# EasyEDA Pro project ProProject_赤兔主板（夜燕flex）111_2024-08-22.epro, board PCB_夜燕Flex
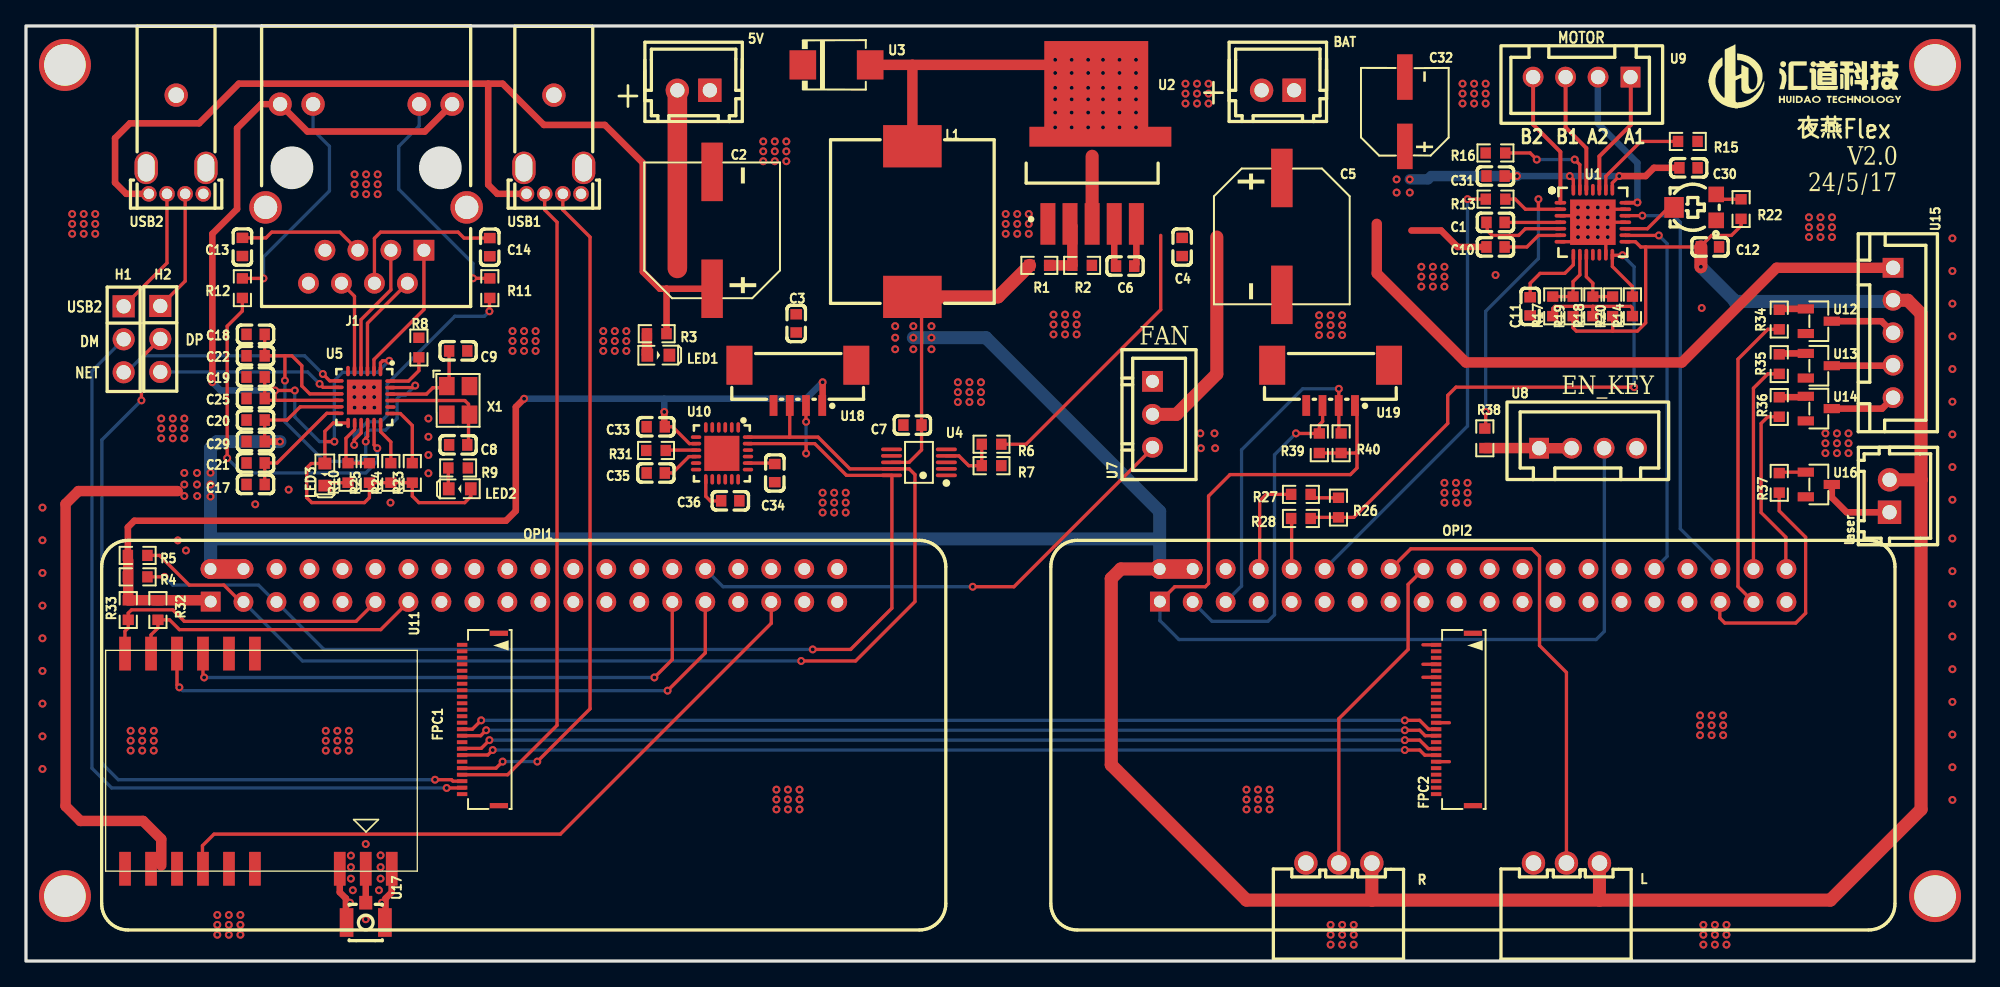
[diagram p2: board, top side]
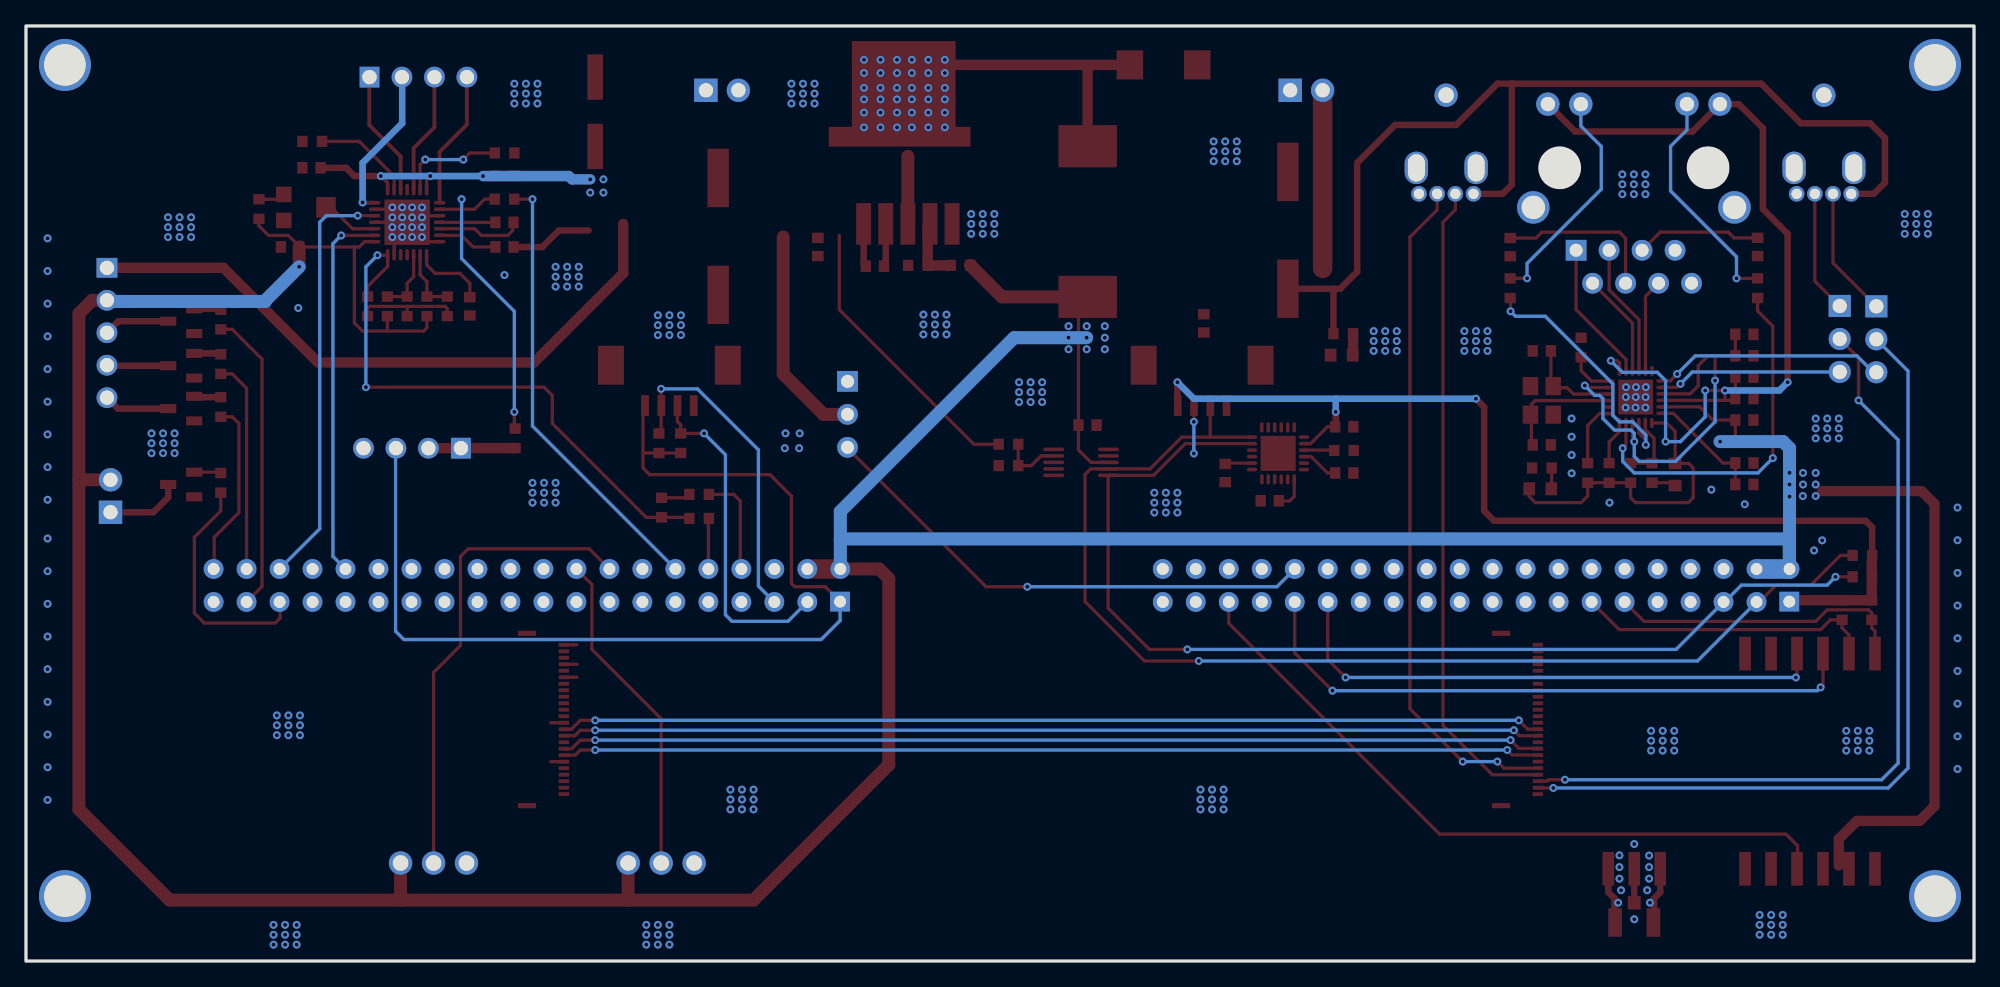
[diagram p3: board, bottom side, seen from below]

Outline 150 x 72 mm; copper layers: Top Layer, Bottom Layer. Coordinates in mm from the lower left corner of the outline.
Outline path: rectangle 0,72 150,0
Stack: Top Layer 0.035mm / Dielectric1 1.51mm FR4 er 4.5 / Bottom Layer 0.035mm

## Design rules (mm)
template: 用户自定义配置
spacing Default (default): track to track 0.152, other pairs 0 to 0.152
track width Default (default): min 0.254, default 0.254, max 25.4
differential pair differentialPair (default): width min 0.127, default 0.254, max 2.54; gap min 0.152, default 0.152
via Default (default): diameter min 0.61, default 0.61, max 100.025; hole min 0.305, default 0.305, max 59.995
net +5V uses power
net 24V uses power

## Placement (name value [footprint] x y rotation side)
5V  ZX-XH2.54-2PZZ  [CONN-TH_2P-P2.50_HX25003-2A]  51.41 67.05 180 top
BAT  ZX-XH2.54-2PZZ  [conn-th_2p-p2.50_hx25003-2a]  96.39 67.05 180 top
C1  22nF  [C0603]  113.16 56.87 0 top
C2  220uF  [CAP-SMD_BD10.0-L10.3-W10.3-LS11.0-FD]  52.83 56.27 90 top
C3  100nF  [C0603]  59.31 49.1 90 top
C4  100nF  [C0603]  89.03 54.98 90 top
C5  220uF  [CAP-SMD_BD10.0-L10.3-W10.3-LS11.0-FD]  96.7 55.8 270 top
C6  1uF  [C0603]  84.63 53.51 0 top
C7  100nF  [C0603]  68.26 41.27 0 top
C8  22pF  [footprint_d276]  33.28 39.74 0 top
C9  22pF  [footprint_d276]  33.28 46.98 0 top
C10  100nF  [C0603]  113.16 54.98 0 top
C11  2.2u  [footprint_d276]  115.82 50.41 90 top
C12  100nF  [C0603]  129.67 54.99 180 top
C13  100nF  [C0603]  16.67 54.98 90 top
C14  100nF  [C0603]  35.71 54.97 90 top
C17  1uF  [C0603]  17.68 36.7 0 top
C18  1uF  [C0603]  17.68 48.25 0 top
C19  4.7uF  [C0603]  17.68 44.97 0 top
C20  4.7uF  [C0603]  17.68 41.66 0 top
C21  100nF  [C0603]  17.68 38.35 0 top
C22  100nF  [C0603]  17.68 46.6 0 top
C25  100nF  [C0603]  17.68 43.31 0 top
C29  100nF  [C0603]  17.68 40 0 top
C30  100nF  [C0603]  128.02 61.08 180 top
C31  100nF  [C0603]  113.16 60.44 0 top
C32  100uF  [CAP-SMD_BD6.3-L6.6-W6.6-LS7.4-FD]  106.17 65.4 90 top
C33  10nF  [C0603]  48.49 41.14 180 top
C34  2.2nF  [C0603]  57.66 37.57 270 top
C35  100nF  [C0603]  48.49 37.58 180 top
C36  100nF  [C0603]  54.23 35.44 180 top
FPC1  F0502-B-24-10G-R  [FPC-SMD_F0502-B-24-10G-R]  35 18.6 90 top
FPC2  F0502-B-24-10G-R  [FPC-SMD_F0502-B-24-10G-R]  110 18.6 90 top
H1  PZ254V-11-03P  [HDR-TH_3P-P2.54-V-M]  7.52 47.87 270 top
H2  PZ254V-11-03P  [HDR-TH_3P-P2.54-V-M]  10.34 47.9 270 top
J1  HR911105A  [RJ45-TH_HR911105A]  26.19 59.08 180 top
L  XH-3AW  [CONN-TH_3P-P2.54_HCTL_XH-3AW]  118.62 7.55 180 top
L1  47uH  [IND-SMD_L13.8-W12.6_YSPI13XX]  68.25 56.94 90 top
laser  ZX-XH2.54-2PZZ  [CONN-TH_2P-P2.50_HX25003-2A]  143.49 35.81 90 top
LED1  LED-0603_R  [footprint_3abe]  48.69 46.65 0 top
LED2  LED-0603_R  [footprint_3abe]  33.4 36.36 180 top
LED3  LED-0603_R  [footprint_3abe]  23.02 37.46 270 top
NOREF  -  [Pad_e399]  147 5 0 top
NOREF#2  -  [Pad_e392]  3 69 0 top
NOREF#3  -  [Pad_e400]  147 69 0 top
NOREF#4  -  [Pad_e398]  3 5 0 top
OPI1  香橙派ZERO2W_正扣  [footprint_d6d0]  37.85 16.5 0 top
OPI2  香橙派ZERO2W_正扣  [footprint_d6d0]  110.93 16.5 0 top
R  XH-3AW  [CONN-TH_3P-P2.54_HCTL_XH-3AW]  101.09 7.55 180 top
R1  15k  [footprint_b147]  78.03 53.57 180 top
R2  4.7k  [footprint_b147]  81.32 53.57 180 top
R3  1k  [footprint_b147]  48.57 48.3 0 top
R4  10kΩ  [R0603]  8.6 29.58 180 top
R5  10kΩ  [R0603]  8.6 31.23 180 top
R6  100k  [footprint_b147]  74.35 39.79 0 top
R7  20k  [footprint_b147]  74.35 38.14 180 top
R8  2.49k  [footprint_b147]  30.25 47.24 90 top
R9  510R  [footprint_b147]  33.27 37.97 0 top
R10  510R  [footprint_b147]  24.79 37.59 90 top
R11  510R  [footprint_b147]  35.72 51.81 90 top
R12  510R  [footprint_b147]  16.66 51.81 90 top
R13  2k  [footprint_b147]  113.16 58.67 0 top
R14  20k  [footprint_b147]  123.7 50.41 90 top
R15  120mR  [footprint_b147]  127.96 63.11 0 top
R16  120mR  [footprint_b147]  113.15 62.22 180 top
R17  0  [footprint_b147]  117.56 50.41 90 top
R18  0  [footprint_b147]  120.65 50.41 90 top
R19  10kΩ  [R0603]  119.13 50.41 90 top
R20  10kΩ  [R0603]  122.17 50.41 90 top
R21  20kΩ  [footprint_3e76]  128.52 58.03 90 top
R22  20k  [footprint_b147]  132.06 57.9 270 top
R23  10kΩ  [R0603]  29.75 37.59 270 top
R24  10kΩ  [R0603]  28.1 37.59 270 top
R25  10kΩ  [R0603]  26.44 37.59 270 top
R26  1k  [footprint_b147]  101.06 34.92 270 top
R27  0  [footprint_b147]  98.17 35.93 0 top
R28  0  [footprint_b147]  98.17 34.08 0 top
R31  4.7K  [R0603]  48.51 39.31 0 top
R32  1k  [R0603]  10.16 27.03 270 top
R33  1k  [R0603]  7.87 27.03 270 top
R34  10  [R0603]  135 49.39 90 top
R35  10  [R0603]  135 45.97 90 top
R36  10  [R0603]  135 42.66 90 top
R37  10  [R0603]  135 36.82 90 top
R38  2K  [R0603]  112.33 40.25 270 top
R39  10kΩ  [R0603]  99.59 39.87 270 top
R40  10kΩ  [R0603]  101.27 39.87 270 top
U1  TMC2209-LA  [footprint_e6f4]  120.65 56.89 270 top
U2  XL4015E1  [footprint_c660]  82.09 61.77 90 top
U3  SS54_C5200096  [footprint_a0e0]  62.41 69 0 top
U4  ADS1115IDGSR  [footprint_abbe]  68.76 38.4 90 top
U5  RTL8152B-VB-CG  [footprint_86b9]  26.06 43.43 270 top
U7  ZX-XH2.54-3PZZ  [CONN-TH_3P-P2.54_2501S-3P]  86.74 42.09 270 top
U8  ZX-XH2.54-4PZZ  [CONN-TH_4P-P2.50_4PIN]  120.26 39.49 0 top
U9  ZX-XH2.54-4PZZ  [CONN-TH_4P-P2.50_4PIN]  119.8 68.06 180 top
U10  MPU-6050_C24112  [QFN-24_L4.0-W4.0-P0.50-BL-EP2.7]  53.6 39.09 180 top
U11  -  [MW1268S]  18.16 15.48 270 top
U12  2N7002K_C3008053  [SOT-23-3_L2.9-W1.3-P1.90-LS2.4-BL-1]  138.05 49.27 270 top
U13  2N7002K_C3008053  [SOT-23-3_L2.9-W1.3-P1.90-LS2.4-BL-1]  138.05 45.84 270 top
U14  2N7002K_C3008053  [SOT-23-3_L2.9-W1.3-P1.90-LS2.4-BL-1]  138.05 42.54 270 top
U15  ZX-XH2.54-5PZZ  [CONN-TH_5P-P2.50_ZX-XH2.54-5PZZ]  143.76 48.38 270 top
U16  2N7002K_C3008053  [SOT-23-3_L2.9-W1.3-P1.90-LS2.4-BL-1]  138.05 36.69 270 top
U17  BWU.FL-IPEX1  [IPEX-SMD_BWIPX-1-001E]  26.16 3.73 270 top
U18  HCZZ0015-4  [CONN-SMD_4P-P1.25_HCZZ0015-4]  59.44 44.33 180 top
U19  HCZZ0015-4  [CONN-SMD_4P-P1.25_HCZZ0015-4]  100.46 44.33 180 top
USB1  AF 14.0 CC-T  [USB-A-TH_AF14.0CC-T]  40.64 62.87 180 top
USB2  AF 14.0 CC-T  [USB-A-TH_AF14.0CC-T]  11.56 62.87 180 top
X1  25MHz  [OSC-SMD_4P-L3.2-W2.5-BL]  33.28 43.17 270 top

## Footprints (pads in the part's own frame, mm; a bottom-side part is the same pattern mirrored in y, then rotated)
C0603
  rect 0.8x0.9 smd: 1(-0.7,0) 2(0.7,0)
CAP-SMD_BD6.3-L6.6-W6.6-LS7.4-FD
  rect 3.5x1.2 smd: 1(-2.67,0) 2(2.67,0)
CAP-SMD_BD10.0-L10.3-W10.3-LS11.0-FD
  rect 4.5x1.65 smd: 1(-4.5,0) 2(4.5,0)
CONN-SMD_4P-P1.25_HCZZ0015-4
  rect 0.6x1.6 smd: 1(-1.875,1.55) 2(-0.625,1.55) 3(0.625,1.55) 4(1.875,1.55)
  rect 2x3 smd: 5(-4.5,-1.55) 6(4.5,-1.55)
CONN-TH_2P-P2.50_HX25003-2A
  rect 1.8x1.8 hole 1.1: 1(-1.25,0)
  round 1.8 hole 1.1: 2(1.25,0)
conn-th_2p-p2.50_hx25003-2a
  rect 1.8x1.8 hole 1.1: 1(-1.25,0)
  round 1.8 hole 1.1: 2(1.25,0)
CONN-TH_3P-P2.54_2501S-3P
  rect 1.6x1.6 hole 1: 1(-2.54,0)
  round 1.6 hole 1: 2(0,0) 3(2.54,0)
CONN-TH_3P-P2.54_HCTL_XH-3AW
  round 1.8 hole 1.199: 1(-2.54,0) 2(0.002,0) 3(2.54,0)
CONN-TH_4P-P2.50_4PIN
  rect 1.524x1.6 hole 1.1: 1(-3.75,0)
  round 1.6 hole 1.1: 2(-1.25,0) 3(1.25,0) 4(3.75,0)
CONN-TH_5P-P2.50_ZX-XH2.54-5PZZ
  rect 1.524x1.6 hole 1.1: 1(-5,0)
  round 1.6 hole 1.1: 2(-2.5,0) 3(0,0) 4(2.5,0) 5(5,0)
footprint_3abe
  rect 0.9x1 smd: 1(-0.85,0) 2(0.85,0)
footprint_3e76
  rect 1.2x1.2 smd: 1(-1,-1.625) 3(1,-1.625)
  rect 1.6x1.5 smd: 2(0,1.625)
footprint_86b9
  oval 0.8x0.28 smd: 1(-2,1.232) 2(-2,0.732) 3(-2,0.231) 4(-2,-0.267) 5(-2,-0.767) 6(-2,-1.268) 13(2,-1.258) 14(2,-0.757) 15(2,-0.257) 16(2,0.241) 17(2,0.742) 18(2,1.242)
  oval 0.28x0.8 smd: 7(-1.244,-2) 8(-0.744,-2) 9(-0.244,-2) 10(0.254,-2) 11(0.754,-2) 12(1.255,-2) 19(1.27,2) 20(0.769,2) 21(0.269,2) 22(-0.229,2) 23(-0.729,2) 24(-1.23,2)
  rect 2.68x2.68 smd: 25(0,-0.013)
footprint_a0e0
  rect 2.047x2.241 smd: 1(-2.591,0) 2(2.591,0)
footprint_abbe
  oval 0.28x1.62 smd: 1(-1,-2.11) 2(-0.5,-2.11) 3(0,-2.11) 4(0.5,-2.11) 5(1,-2.11) 6(1,2.11) 7(0.5,2.11) 8(0,2.11) 9(-0.5,2.11) 10(-1,2.11)
footprint_b147
  rect 0.806x0.864 smd: 1(-0.753,0) 2(0.753,0)
footprint_c660
  rect 3.2x1.15 smd: 1(-5.008,3.404) 2(-5.008,1.702) 3(-5.008,0) 4(-5.008,-1.702) 5(-5.008,-3.404)
  custom 8.128x10.922 smd: 6(5.008,-0.318)
footprint_d6d0
  rect 1.524x1.524 hole 0.914: 1(-23.622,11.176)
  round 1.524 hole 0.914: 2(-21.098,11.148) 3(-18.558,11.148) 4(-16.018,11.148) 5(-13.478,11.148) 6(-10.938,11.148) 7(-8.398,11.148) 8(-5.858,11.148) 9(-3.318,11.148) 10(-0.778,11.148) 11(1.762,11.148) 12(4.302,11.148) 13(6.841,11.148) 14(9.382,11.148) 15(11.921,11.148) 16(14.461,11.148) 17(17.002,11.148) 18(19.541,11.148) 19(22.081,11.148) 20(24.622,11.148) 21(24.622,13.688) 22(22.081,13.688) 23(19.541,13.688) 24(17.002,13.688) 25(14.461,13.688) 26(11.921,13.688) 27(9.382,13.688) 28(6.841,13.688) 29(4.302,13.688) 30(1.762,13.688) 31(-0.778,13.688) 32(-3.318,13.688) 33(-5.858,13.688) 34(-8.398,13.688) 35(-10.938,13.688) 36(-13.478,13.688) 37(-16.018,13.688) 38(-18.558,13.688) 39(-21.098,13.688) 40(-23.638,13.688)
footprint_d276
  rect 0.8x0.9 smd: 1(-0.7,0) 2(0.7,0)
footprint_e6f4
  oval 0.28x0.9 smd: 1(-1.501,-2.5) 2(-1.001,-2.5) 3(-0.5,-2.5) 4(0,-2.5) 5(0.5,-2.5) 6(1.001,-2.5) 7(1.501,-2.5) 15(1.501,2.5) 16(1.001,2.5) 17(0.5,2.5) 18(0,2.5) 19(-0.5,2.5) 20(-1.001,2.5) 21(-1.501,2.5)
  oval 0.9x0.28 smd: 8(2.5,-1.501) 9(2.5,-1.001) 10(2.5,-0.5) 11(2.5,0) 12(2.5,0.5) 13(2.5,1.001) 14(2.5,1.501) 22(-2.5,1.501) 23(-2.5,1.001) 24(-2.5,0.5) 25(-2.5,0) 26(-2.5,-0.5) 27(-2.5,-1.001) 28(-2.5,-1.501)
  rect 3.5x3.5 smd: 29(-0.001,0)
FPC-SMD_F0502-B-24-10G-R
  rect 0.3x0.8 smd: 1(5.75,1.417) 2(5.25,1.417) 3(4.75,1.417) 4(4.25,1.417) 5(3.75,1.417) 6(3.25,1.417) 7(2.751,1.417) 8(2.25,1.417) 9(1.75,1.417) 10(1.25,1.417) 11(0.75,1.417) 12(0.25,1.417) 13(-0.25,1.417) 14(-0.75,1.417) 15(-1.25,1.417) 16(-1.75,1.417) 17(-2.25,1.417) 18(-2.75,1.417) 19(-3.25,1.417) 20(-3.75,1.417) 21(-4.25,1.417) 22(-4.75,1.417) 23(-5.25,1.417) 24(-5.75,1.417)
  rect 0.4x1.4 smd: 25(-6.635,-1.417) 26(6.635,-1.417)
HDR-TH_3P-P2.54-V-M
  rect 1.7x1.7 hole 1.1: 1(-2.54,0)
  round 1.7 hole 1.1: 2(0,0) 3(2.54,0)
IND-SMD_L13.8-W12.6_YSPI13XX
  rect 3.25x4.5 smd: 1(-5.8,0) 2(5.8,0)
IPEX-SMD_BWIPX-1-001E
  rect 1.05x1 smd: 1(-0.762,0)
  rect 2.2x1.05 smd: 2(0.762,-1.475) 3(0.762,1.475)
MW1268S
  rect 2.6x0.9 smd: 1(-8.187,-0.532) 2(-8.187,-2.532) 3(-8.187,-4.532) 4(-8.187,-6.532) 5(-8.187,-8.532) 6(-8.187,-10.532) 7(8.382,-10.532) 8(8.382,-8.532) 9(8.382,-6.532) 10(8.382,-4.532) 11(8.382,-2.532) 12(8.382,-0.532) 13(8.382,6.001) 14(8.382,8.001) 15(8.382,10.001)
OSC-SMD_4P-L3.2-W2.5-BL
  rect 1.4x1.2 smd: 1(-1.1,-0.875) 2(1.1,-0.875) 3(1.1,0.875) 4(-1.1,0.875)
Pad_e392
  round 4 hole 3.2: 1(0,0)
Pad_e398
  round 4 hole 3.2: 1(0,0)
Pad_e399
  round 4 hole 3.2: 1(0,0)
Pad_e400
  round 4 hole 3.2: 1(0,0)
QFN-24_L4.0-W4.0-P0.50-BL-EP2.7
  oval 0.28x0.8 smd: 1(-1.25,-2) 2(-0.75,-2) 3(-0.25,-2) 4(0.25,-2) 5(0.75,-2) 6(1.25,-2) 13(1.25,2) 14(0.75,2) 15(0.25,2) 16(-0.25,2) 17(-0.75,2) 18(-1.242,2)
  oval 0.8x0.28 smd: 7(2,-1.25) 8(2,-0.75) 9(2,-0.25) 10(2,0.25) 11(2,0.75) 12(2,1.25) 19(-2,1.25) 20(-2,0.75) 21(-2,0.25) 22(-2,-0.25) 23(-2,-0.75) 24(-2,-1.25)
  rect 2.7x2.7 smd: 25(0.013,0)
R0603
  rect 0.806x0.864 smd: 1(-0.753,0) 2(0.753,0)
RJ45-TH_HR911105A
  rect 1.6x1.6 hole 1: 1(-4.45,4.355)
  round 1.6 hole 1: 2(-3.18,6.895) 3(-1.91,4.355) 4(-0.64,6.895) 5(0.63,4.355) 6(1.9,6.895) 7(3.17,4.355) 8(4.44,6.895)
  round 1.8 hole 1.1: 9(-6.625,-6.895) 10(-4.085,-6.895) 11(4.085,-6.895) 12(6.625,-6.895)
  round 2.5 hole 1.8: SH1(-7.745,1.055) SH2(7.745,1.055)
SOT-23-3_L2.9-W1.3-P1.90-LS2.4-BL-1
  rect 0.7x1.25 smd: 1(-0.95,-1) 2(0.95,-1) 3(0,1)
USB-A-TH_AF14.0CC-T
  round 1.2 hole 0.8: 1(2.1,3.8) 2(0.7,3.8) 3(-0.7,3.8) 4(-2.1,3.8)
  oval 1.8x2.5 hole 1.3x2.1: 5(-2.3,1.8) 5(2.3,1.8)
  round 1.8 hole 1.2: 5(-0.01,-3.8)

## Nets
As in the schematic.

Pads without a net: FPC1 2 3 5 7 8 9 10 11 12 16; FPC2 2 3 5 7 8 9 10 11 12 16; J1 7; NOREF 1; NOREF#2 1; NOREF#3 1; NOREF#4 1; OPI1 4 8 9 10 11 12 14 17 19 21 22 23 27 28 29 30 32 33 35 36 37; OPI2 4 6 7 8 9 10 11 12 14 15 16 17 27 28 29 30; U1 11 12 25; U4 5 6 7; U10 2 3 4 5 6 7 12 14 15 16 17 19 21 22; U11 2 11 12

## Via types
v1: diameter 0.62, hole 0.31, Top Layer to Bottom Layer, 3 vias
v2: diameter 0.61, hole 0.305, Top Layer to Bottom Layer, 419 vias

## Routing (per net, layer and track width the routed paths; a pad name or vN(x,y) marks a point on that pad's centre or on a via; arc(x,y) is an arc through that point)
3V3: length 2.5
  Top Layer w0.254: U10.13 52.35,35.78 52.7,35.42 53.39,35.42 53.4,35.44
3V3_1: length 81.4
  Top Layer w0.254: C33.1 49.78,41.14 51.08,39.84 U10.8
  Top Layer w0.5: v2(61.34,44.57) 61.34,42.81 U18.1 ; v2(49.15,42.28) 49.15,41.18 C33.1 ; R5.2 7.84,33.4 8.34,33.9 36.96,33.9 37.72,34.66 37.72,42.66 v2(38.35,43.3)
  Top Layer w0.8: 7.87,30.84 R33.1 R32.1 14.12,27.78 OPI1.1
  Bottom Layer w0.5: v2(61.34,44.57) 60.07,43.3 49.15,43.3 ; 49.15,43.3 v2(38.35,43.3) ; 49.15,43.3 v2(49.15,42.28)
3V3_2: length 81.8
  Top Layer w0.254: R39.2 R40.2 102.37,39.12 102.49,39.23 ; 102.49,39.23 102.49,42.81 ; 102.49,39.23 102.49,37.96 101.98,37.46 92.71,37.46 91.06,35.81 91.06,29.07 90.81,28.82 88.46,28.82 87.31,27.68
  Bottom Layer w0.254: 87.31,27.68 87.31,26.22 88.77,24.76 120.9,24.76 121.54,25.39 121.54,39.46 U8.3
24V: length 122.6
  Top Layer w0.254: v2(118.87,60.44) 119.15,60.17 U1.28 ; v2(122.68,60.44) 122.15,59.91 U1.22 ; R6.2 77.01,39.79 87.38,50.16 87.38,55.87
  Top Layer w0.5: U2.5 85.5,53.67 85.34,53.51 ; v2(122.68,60.44) 124.71,60.44 125.35,61.08 C30.2 ; v2(114.81,60.44) C31.2 ; 112.46,54.98 110.24,54.98 108.97,56.25 106.68,56.25
  Top Layer w0.8: 104.01,56.76 104.01,52.95 110.87,46.09 127.51,46.09 134.79,53.38 U15.1
  Top Layer w1: U7.2 88.59,42.09 91.69,45.2 91.69,55.74
  Bottom Layer w0.5: v2(122.68,60.44) v2(118.87,60.44) v2(114.81,60.44)
  Bottom Layer w0.8: v2(106.55,60.19) 107.95,60.19 108.2,60.44 v2(114.81,60.44)
  vias: v2(105.54,60.19) v2(105.54,59.17) v2(106.55,59.17)
+5V: length 475.7
  Top Layer w0.254: U5.11 21.12,42.67 20.09,41.65 20.09,41.66 C20.2 C29.2 ; 122.17,48.5 124.08,48.5 124.71,49.14 124.71,54.98 ; 122.17,48.5 R20.1 ; 122.17,48.5 119.38,48.5 119.13,48.76 R19.1 ; 124.71,54.98 124.33,54.98 123.93,55.39 U1.15 ; 124.71,54.98 128.91,54.98 129.79,55.87 131.32,55.87 132.06,56.62 R22.2 ; L1.1 68.96,50.43 68.96,39.36 68,38.4 U4.8
  Top Layer w0.5: v2(19.56,40) 18.39,40 C29.2 ; 35.59,67.56 16.38,67.56 13.33,64.51 8,64.51 6.86,63.36 6.86,59.94 7.72,59.07 9.46,59.07 ; 35.59,67.56 35.59,59.78 36.29,59.07 USB1.1 ; 35.59,67.56 36.7,67.56 39.88,64.38 44.58,64.38 47.5,61.46 47.5,53.08 48.81,51.77 49.32,51.77 ; 49.32,51.77 C2.1 ; 49.32,51.77 49.32,48.31 R3.2
  Top Layer w0.8: 11.68,36.19 4.04,36.19 3.05,35.2 3.05,11.93 4.19,10.79 9.02,10.79 10.41,9.39 10.41,7.36
  Top Layer w1: 77.28,53.57 74.85,51.14 L1.1 ; 87.29,30.19 84.3,30.19 83.57,29.45 83.57,15.1 93.98,4.69 103.65,4.69 ; 103.65,4.69 121.16,4.69 ; 103.65,4.69 103.63,4.7 R.1 ; 145.92,37.06 145.92,11.68 138.94,4.69 121.16,4.69 ; 145.92,37.06 laser.2 ; 145.92,37.06 145.92,49.85 144.9,50.88 U15.2 ; C12.2 v2(128.97,53.46) ; 121.16,4.69 L.1
  Top Layer w1.5: OPI1.40 OPI1.39 ; 87.29,30.19 OPI2.39 ; 50.16,53.33 5V.2
  Bottom Layer w0.8: v2(14.21,36.69) 14.22,36.73 14.21,36.75
  Bottom Layer w1: v2(68.33,48) v2(69.72,48) 73.91,48 87.29,34.62 87.29,32.41 ; 14.22,30.19 14.22,32.5 87.2,32.5 87.29,32.41 ; 87.29,32.41 87.29,30.19 ; U15.2 143.68,50.79 131.57,50.79 131.57,50.85 v2(128.97,53.46) ; OPI1.40 v2(14.21,35.76) v2(14.21,36.69) v2(14.21,37.59) 14.21,39.5 14.71,40 v2(19.56,40) ; 16.75,30.32 16.62,30.19
  Bottom Layer w1.5: 16.62,30.19 14.22,30.19
  vias: v2(12.19,37.58) v2(12.19,36.69) v2(12.19,35.81) v2(13.17,37.58) v2(13.17,36.69) v2(13.19,35.81) v2(66.93,48.89) v2(66.93,48) v2(66.93,47.11) v2(68.33,48.89) v2(68.33,47.11) v2(69.72,48.89) v2(69.72,47.11)
GND: length 36.2
  Top Layer w0.254: FPC2.19 109.6,15.35 ; R18.1 120.65,50.41 ; 120.65,50.41 117.73,50.41 117.56,50.24 R17.1 ; 120.65,50.41 123.57,50.41 123.7,50.28 R14.1 ; FPC2.4 107.57,22.85 ; U1.7 119.15,55.39 v2(119.51,55.74) v2(120.27,56.51) U1.29 ; U1.29 v2(121.03,56.51) 121.65,55.89 U1.13 ; U1.29 U1.18 ; U1.29 121.65,57.89 U1.20 ; U1.29 120.15,57.39 U1.3 ; FPC2.13 109.6,18.35 ; FPC2.1 107.57,24.35 ; FPC2.6 107.57,21.85
  Top Layer w0.5: U17.3 27.69,3.02 27.69,4.82 28.16,5.29 U11.15 ; U17.2 24.64,3.02 24.64,4.82 24.16,5.29 U11.13
  vias: v2(1.27,34.92) v2(1.27,32.4) v2(1.27,29.88) v2(1.27,27.37) v2(1.27,24.85) v2(1.27,22.33) v2(1.27,19.82) v2(1.27,17.3) v2(1.27,14.79) v2(3.56,57.52) v2(3.56,56.76) v2(3.56,56) v2(4.44,57.52) v2(4.44,56.76) v2(4.44,56) v2(5.33,57.52) v2(5.33,56.76) v2(5.33,56) v2(8.06,17.73) v2(8.06,16.97) v2(8.06,16.2) v2(8.95,17.73) v2(8.95,16.97) v2(8.95,16.2) v2(9.84,17.73) v2(9.84,16.97) v2(9.84,16.2) v2(10.41,41.77) v2(10.41,41.01) v2(10.41,40.25) v2(11.3,41.77) v2(11.3,41.01) v2(11.3,40.25) v2(11.69,32.39) v2(12.19,41.77) v2(12.19,41.01) v2(12.19,40.25) v2(12.32,31.61) v2(14.73,3.55) v2(14.73,2.78) v2(14.73,2.02) v2(15.62,3.55) v2(15.62,2.78) v2(15.62,2.02) v2(16.51,3.55) v2(16.51,2.78) v2(16.51,2.02) v2(17.65,35.17) v2(20.23,36.3) v2(23.08,17.73) v2(23.08,16.97) v2(23.08,16.2) v2(23.97,17.73) v2(23.97,16.97) v2(23.97,16.2) v2(24.86,17.73) v2(24.86,16.97) v2(24.86,16.2) v2(25.02,8.12) v2(25.02,7.23) v2(25.02,6.34) v2(24.95,4.49) v2(25.17,5.45) v2(25.3,60.57) v2(25.3,59.81) v2(25.3,59.05) v2(25.27,44.19) v2(25.29,43.43) v2(25.3,42.62) v2(26.03,44.19) v2(26.05,43.43) v2(26.06,42.62) v2(26.19,60.57) v2(26.19,59.81) v2(26.19,59.05) v2(26.16,9.01) v2(26.16,3.22) v2(26.8,44.19) v2(26.81,43.43) v2(26.83,42.62) v2(27.08,60.57) v2(27.08,59.81) v2(27.08,59.05) v2(27.18,5.45) v2(27.31,8.14) v2(27.31,7.23) v2(27.31,6.34) v2(27.41,4.49) v2(28.07,35.3) v2(30.99,41.77) v2(30.99,40.37) v2(30.99,38.96) v2(30.99,37.56) v2(37.47,48.5) v2(37.47,47.74) v2(37.47,46.98) v2(38.35,48.5) v2(38.35,47.74) v2(38.35,46.98) v2(39.24,48.5) v2(39.24,47.74) v2(39.24,46.98) v2(44.45,48.5) v2(44.45,47.74) v2(44.45,46.98) v2(45.34,48.5) v2(45.34,47.74) v2(45.34,46.98) v2(46.23,48.5) v2(46.23,47.74) v2(46.23,46.98) v2(56.77,63.11) v2(56.77,62.35) v2(56.77,61.59) v2(57.66,63.11) v2(57.66,62.35) v2(57.66,61.59) v2(57.78,13.2) v2(57.78,12.44) v2(57.78,11.68) v2(58.55,63.11) v2(58.55,62.35) v2(58.55,61.59) v2(58.67,13.2) v2(58.67,12.44) v2(58.67,11.68) v2(59.56,13.2) v2(59.56,12.44) v2(59.56,11.68) v2(61.34,36.06) v2(61.34,35.3) v2(61.34,34.53) v2(62.23,36.06) v2(62.23,35.3) v2(62.23,34.53) v2(63.12,36.06) v2(63.12,35.3) v2(63.12,34.53) v2(71.75,44.57) v2(71.75,43.81) v2(71.75,43.04) v2(72.64,44.57) v2(72.64,43.81) v2(72.64,43.04) v2(73.53,44.57) v2(73.53,43.81) v2(73.53,43.04) v2(75.44,57.52) v2(75.44,56.76) v2(75.44,56) v2(76.33,57.52) v2(76.33,56.76) v2(76.33,56) v2(77.22,57.52) v2(77.22,56.76) v2(77.22,56) v2(79.12,49.78) v2(79.12,49.01) v2(79.12,48.25) v2(80.01,49.78) v2(80.01,49.01) v2(80.01,48.25) v2(80.9,49.78) v2(80.9,49.01) v2(80.9,48.25) v2(89.28,67.56) v2(89.28,66.79) v2(89.28,66.03) v2(90.17,67.56) v2(90.17,66.79) v2(90.17,66.03) v2(90.42,40.63) v2(90.47,39.49) v2(91.06,67.56) v2(91.06,66.79) v2(91.06,66.03) v2(91.51,40.63) v2(91.57,39.49) v2(93.98,13.2) v2(93.98,12.44) v2(93.98,11.68) v2(94.87,13.2) v2(94.87,12.44) v2(94.87,11.68) v2(95.76,13.2) v2(95.76,12.44) v2(95.76,11.68) v2(99.57,49.73) v2(99.57,48.96) v2(99.57,48.2) v2(100.46,49.73) v2(100.46,48.96) v2(100.46,48.2) v2(100.46,2.78) v2(100.46,2.02) v2(100.46,1.26) v2(101.35,49.73) v2(101.35,48.96) v2(101.35,48.2) v2(101.35,2.78) v2(101.35,2.02) v2(101.35,1.26) v2(102.24,2.78) v2(102.24,2.02) v2(102.24,1.26) v2(107.44,53.46) v2(107.44,52.7) v2(107.44,51.93) v2(108.33,53.46) v2(108.33,52.7) v2(108.33,51.93) v2(109.22,53.46) v2(109.22,52.7) v2(109.22,51.93) v2(109.22,36.82) v2(109.22,36.06) v2(109.22,35.3) v2(110.11,36.82) v2(110.11,36.06) v2(110.11,35.3) v2(110.62,67.56) v2(110.62,66.79) v2(110.62,66.03) v2(111,36.82) v2(111,36.06) v2(111,35.3) v2(111.51,67.56) v2(111.51,66.79) v2(111.51,66.03) v2(112.4,67.56) v2(112.4,66.79) v2(112.4,66.03) v2(113.16,52.82) v2(119.51,58.03) v2(119.51,57.26) v2(119.51,56.51) v2(120.27,58.03) v2(120.27,57.26) v2(120.27,55.74) v2(121.03,58.03) v2(121.03,57.26) v2(121.03,55.74) v2(121.79,58.03) v2(121.79,57.26) v2(121.79,56.51) v2(121.79,55.74) v2(128.91,18.91) v2(128.91,18.15) v2(128.91,17.39) v2(129.03,50.28) v2(129.16,2.78) v2(129.16,2.02) v2(129.16,1.26) v2(129.79,18.91) v2(129.79,18.15) v2(129.79,17.39) v2(130.05,2.78) v2(130.05,2.02) v2(130.05,1.26) v2(130.68,18.91) v2(130.68,18.15) v2(130.68,17.39) v2(130.94,2.78) v2(130.94,2.02) v2(130.94,1.26) v2(137.29,57.27) v2(137.29,56.51) v2(137.29,55.74) v2(138.18,57.27) v2(138.18,56.51) v2(138.18,55.74) v2(138.56,40.63) v2(138.56,39.87) v2(138.56,39.11) v2(139.06,57.27) v2(139.06,56.51) v2(139.06,55.74) v2(139.45,40.63) v2(139.45,39.87) v2(139.45,39.11) v2(140.34,40.63) v2(140.34,39.87) v2(140.34,39.11) v2(148.34,55.65) v2(148.34,53.13) v2(148.34,50.62) v2(148.34,48.1) v2(148.34,45.58) v2(148.34,43.07) v2(148.34,40.55) v2(148.34,38.04) v2(148.34,35.52) v2(148.34,32.53) v2(148.34,30.02) v2(148.34,27.5) v2(148.34,24.99) v2(148.34,22.47) v2(148.34,19.95) v2(148.34,17.44) v2(148.34,14.92) v2(148.34,12.41)
VDD10: length 33.7
  Top Layer w0.254: 19.94,46.6 20.48,46.6 21.24,45.84 21.24,44.28 21.85,43.67 U5.9 ; 19.94,46.6 v2(19.94,44.69) ; 19.94,46.6 C22.2 C18.2 ; 26.31,41.43 26.31,40.39 26.16,40.25 v2(26.16,40) ; v2(29.97,44.31) 29.81,44.16 U5.23
  Bottom Layer w0.254: v2(29.97,44.31) 29.21,43.55 28.83,43.55 28.58,43.3 28.58,41.77 27.69,40.89 26.42,40.89 26.16,40.63 v2(26.16,40) 26.16,38.85 25.78,38.47 22.99,38.47 19.94,41.52 v2(19.94,44.69)
VDD10_UPS: length 8.9
  Top Layer w0.254: C17.2 C21.2 19.34,38.35 23.16,42.17 U5.12
VDD33: length 96.2
  Top Layer w0.254: 34.25,36.36 34.25,35.77 33.78,35.3 30.25,35.3 29.75,35.81 R23.2 R24.2 R25.2 26.44,35.68 26.06,35.3 22,35.3 21.62,35.68 21.62,37.97 21.96,38.31 LED3.1 23.02,40 ; v2(23.75,40) 23.02,40 23.02,40 ; U5.10 19.17,43.17 ; 19.17,43.17 18.52,43.17 C25.2 C19.2 ; 19.17,43.17 19.18,43.18 v2(19.18,43.93) v2(20.7,43.93) ; 23.02,40 23.02,40.79 23.66,41.43 U5.13 ; U5.1 27.3,46.06 27.46,46.22 v2(27.97,46.22)
  Top Layer w0.5: v2(14.35,44.57) 14.35,56 16.26,57.9 16.26,64.13 18.11,65.98 J1.12 21.67,63.87 30.71,63.87 J1.9
  Bottom Layer w0.254: v2(27.97,46.22) 27.08,45.33 24.38,45.33 23.75,44.69 v2(23.75,40) 22.61,40 20.7,41.9 v2(20.7,43.93)
  Bottom Layer w0.5: v2(14.35,44.57) 14.99,43.93 v2(19.18,43.93)
A1: length 9.7
  Top Layer w0.3: 121.15,59.39 121.15,61.96 123.57,64.38 123.57,68.04 U9.1
A2: length 11.9
  Top Layer w0.3: U1.21 124.06,58.39 v1(124.08,58.41)
  Bottom Layer w0.5: U9.2 121.03,68.05 121.03,64.51 124.08,61.46 v1(124.08,58.41)
B1: length 9.3
  Top Layer w0.3: U9.3 118.55,64.19 120.15,62.59 120.15,59.39
B2: length 10.5
  Top Layer w0.3: U1.1 118.15,62.31 116.05,64.41 U9.4
EPHY-RXN: length 75.5
  Top Layer w0.254: v2(35.94,16.25) 35.56,15.87 33.4,15.87 ; FPC2.18 107.71,15.85 107.31,16.25 v2(106.17,16.25)
  Bottom Layer w0.254: v2(106.17,16.25) v2(35.94,16.25)
EPHY-RXP: length 75.7
  Top Layer w0.254: v2(35.69,17.01) 35.05,16.37 33.41,16.37 ; v2(106.17,17.01) 107.31,17.01 107.97,16.35 FPC2.17
  Bottom Layer w0.254: v2(106.17,17.01) v2(35.69,17.01)
EPHY-TXN: length 75.3
  Top Layer w0.254: v2(35.43,17.77) 35.01,17.35 FPC1.15 ; v2(106.17,17.77) 107.31,17.77 107.74,17.35 FPC2.15
  Bottom Layer w0.254: v2(35.43,17.77) v2(106.17,17.77)
EPHY-TXP: length 75.6
  Top Layer w0.254: v2(35.05,18.53) 34.37,17.85 FPC1.14 ; v2(106.17,18.53) 107.31,18.53 108,17.85 FPC2.14
  Bottom Layer w0.254: v2(35.05,18.53) v2(106.17,18.53)
FAN: length 39.4
  Top Layer w0.254: 86.74,39.49 76.07,28.82 v2(72.9,28.82)
  Bottom Layer w0.254: v2(72.9,28.82) 53.68,28.82 OPI1.25
GPIO: length 5.2
  Top Layer w0.254: 25.31,41.43 25.31,40.92 24.64,40.25 24.64,38.34 R25.1
LANWEAK: length 5
  Top Layer w0.254: U5.19 28.83,42.16 29.75,41.24 R23.1
LED_LINK: length 19.5
  Top Layer w0.254: v2(25.27,39.74) 25.27,40.12 25.81,40.66 U5.15 ; v2(35.69,50.03) 35.69,51.03 R11.1
  Bottom Layer w0.254: v2(35.69,50.03) 35.31,49.65 33.02,49.65 27.81,44.44 27.81,42.03 27.31,41.52 26.29,41.52 25.27,40.5 v2(25.27,39.74)
LED_SPEED: length 28.3
  Top Layer w0.254: U5.17 26.81,39.73 v2(27.05,39.49) ; R12.1 16.66,50.06 15.49,48.89 v2(15.49,38.73)
  Bottom Layer w0.254: v2(27.05,39.49) 27.05,38.47 26.16,37.58 16.64,37.58 v2(15.49,38.73)
LEFT: length 36.8
  Top Layer w0.254: 105.07,30.19 106.63,31.74 115.95,31.74 116.54,31.15 116.54,24.29 118.62,22.22 L.2
MOTOR_DIR: length 32.4
  Top Layer w0.254: U1.19 123.16,57.39 v2(124.46,57.39)
  Bottom Layer w0.254: OPI2.23 127.38,33.28 127.38,56.89 126.87,57.39 v2(124.46,57.39)
MOTOR_EN: length 24.6
  Top Layer w0.254: U1.2 116.46,57.89 ; 116.46,57.89 v2(116.46,58.67) ; 116.46,57.89 115.46,57.89 114.68,58.67 R13.2 ; 112.4,41.07 v2(112.4,42.28)
  Bottom Layer w0.254: v2(112.4,42.28) 112.4,50.03 116.46,54.09 v2(116.46,58.67)
MOTOR_EN_PIN: length 34.4
  Top Layer w0.254: v2(111,58.67) R13.1
  Bottom Layer w0.254: 99.99,30.19 111,41.19 v2(111,58.67)
MOTOR_STEP: length 28.9
  Top Layer w0.254: U1.16 123.17,55.87 v2(125.73,55.87)
  Bottom Layer w0.254: v2(125.73,55.87) 126.37,55.24 126.37,31.16 OPI2.25
NET_DM: length 17.9
  Top Layer w0.254: v2(22.86,45.2) 23.39,44.67 U5.7
  Bottom Layer w0.254: H1.3 7.75,45.33 9.02,46.6 21.46,46.6 v2(22.86,45.2)
NET_DP: length 14.2
  Top Layer w0.254: U5.8 22.88,44.17 v2(22.61,44.44)
  Bottom Layer w0.254: v2(22.61,44.44) 21.69,45.36 H2.3
PI19_1: length 42.9
  Top Layer w0.254: OPI1.15 49.77,23.22 v2(48.39,21.83) ; U11.3 13.63,21.92 v2(13.72,21.83)
  Bottom Layer w0.254: v2(13.72,21.83) v2(48.39,21.83)
PI20_1: length 48.4
  Top Layer w0.254: v2(49.4,20.82) 52.31,23.72 OPI1.16 ; U11.4 11.63,21.25 v2(11.81,21.07)
  Bottom Layer w0.254: v2(11.81,21.07) 12.06,20.82 v2(49.4,20.82)
PI23_1: length 54.3
  Top Layer w0.254: U11.10 13.59,7.14 13.59,8.88 14.48,9.77 41.15,9.77 57.39,26.01 OPI1.18
PI23_2: length 18.5
  Top Layer w0.254: OPI2.18 130.43,27.6 130.43,26.41 130.81,26.03 136.27,26.03 137.03,26.79 137.03,32.63 135,34.66 R37.1
PI25_2: length 23.3
  Top Layer w0.254: OPI2.19 131.83,28.84 131.83,46.35 134.12,48.64 R34.1
PI26_2: length 16.4
  Top Layer w0.254: R35.1 134.12,45.21 133.01,44.11 OPI2.22
PI27_2: length 13.6
  Top Layer w0.254: R36.1 134.12,41.91 133.6,41.39 133.6,34.53 135.51,32.63 135.51,30.23 OPI2.21
RIGHT: length 25.3
  Top Layer w0.254: OPI2.32 106.43,29 106.43,23.99 101.09,18.66 101.09,7.55
SCL_1: length 87.3
  Top Layer w0.254: U18.2 60.06,41.53 v2(60.07,41.52) ; 60.09,39.84 60.07,39.82 v2(60.07,39.08) ; 60.09,39.84 U10.23 ; 60.09,39.84 60.73,39.84 63.18,37.4 U4.10 66.68,37.37 66.68,27.17 63.5,23.99 v2(60.58,23.99) ; 9.77,29.58 v2(10.67,29.58)
  Bottom Layer w0.254: v2(60.07,41.52) v2(60.07,39.08) ; v2(60.58,23.99) 22.94,23.99 OPI1.3 19.21,27.65 17.91,28.95 11.3,28.95 v2(10.67,29.58)
SCL_2: length 25.2
  Top Layer w0.254: R40.1 101.09,40.8 v2(101.09,44.06)
  Bottom Layer w0.254: 92.37,27.65 93.6,28.87 93.6,39.36 98.3,44.06 v2(101.09,44.06)
SDA_1: length 90.2
  Top Layer w0.254: 58.78,40.34 58.81,40.37 U18.3 ; 58.78,40.34 61,40.34 63.44,37.9 U4.9 68.01,37.9 68.45,37.46 68.45,27.68 63.88,23.11 v2(59.69,23.11) ; 58.78,40.34 U10.24 ; OPI1.2 16.54,27.65 15.24,28.95 12.57,28.95 10.29,31.23 9.77,31.23
  Bottom Layer w0.254: OPI1.2 21.29,23.11 v2(59.69,23.11)
SDA_2: length 25.7
  Top Layer w0.254: v2(97.79,40.63) 97.8,40.62 R39.1 99.59,41.29 99.84,41.54 99.84,42.66
  Bottom Layer w0.254: OPI2.2 91.33,26.15 95.63,26.15 96.14,26.66 96.14,38.98 v2(97.79,40.63)
SPI_SDI: length 3.4
  Top Layer w0.254: R24.1 28.1,39.97 27.31,40.76 U5.18
UART0_RX_2: length 45.5
  Top Layer w0.254: R14.2 123.7,51.93 122.15,53.48 U1.14 122.19,54.35 v2(122.94,54.35) ; R28.2 99.01,34.16 R26.2 102.24,34.16 109.47,41.39 109.47,43.55 110.11,44.19 v2(123.82,44.19)
  Bottom Layer w0.254: v2(123.82,44.19) 123.82,53.46 v2(122.94,54.35)
UART0_TX_2: length 2.2
  Top Layer w0.254: R27.2 99.19,35.67 R26.1
UART5_RX_1: length 23.3
  Top Layer w0.254: U11.5 9.63,25.11 10.16,25.64 R32.2 11.06,26.27 11.81,25.52 27.32,25.52 OPI1.7
UART5_TX_1: length 23.4
  Top Layer w0.254: U11.6 7.62,23.68 7.62,25.39 7.87,25.64 R33.2 7.87,26.79 8.13,27.04 11.3,27.04 12.19,26.15 25.41,26.15 OPI1.6
USB2-DM1: length 50.4
  Top Layer w0.254: 33.37,14.34 37.08,14.34 40.89,18.15 40.89,56.89 39.94,57.84 USB1.2
USB2-DP1: length 52.5
  Top Layer w0.254: v2(36.7,15.36) 36.19,14.85 33.38,14.85 ; v2(39.37,15.36) 43.43,19.42 43.43,55.74 41.34,57.84 USB1.3
  Bottom Layer w0.254: v2(39.37,15.36) v2(36.7,15.36)
USB3-DM1: length 63.4
  Top Layer w0.254: 33.81,13.33 v2(32.39,13.33)
  Bottom Layer w0.254: v2(7.52,47.87) 5.08,45.43 5.08,14.85 6.6,13.33 v2(32.39,13.33)
USB3-DP1: length 62.8
  Top Layer w0.254: FPC1.22 32.88,13.85 32.77,13.96 v2(31.5,13.96) ; v2(8.89,43.17) 8.89,46.45 H2.2
  Bottom Layer w0.254: v2(31.5,13.96) 7.11,13.96 5.84,15.23 5.84,40.12 v2(8.89,43.17)
USB-DM: length 10
  Top Layer w0.254: USB2.2 10.86,53.75 7.52,50.41
USB-DP: length 9.4
  Top Layer w0.254: H2.1 12.26,52.35 USB2.3
$2N1: length 4.3
  Top Layer w0.254: C1.2 118.14,56.87 U1.4
$2N2: length 6.6
  Top Layer w0.254: U1.5 115.45,56.39 114.94,55.87 112.9,55.87 112.52,56.25 112.52,56.81 112.46,56.87
$2N3: length 29.8
  Top Layer w0.8: 82.41,66.77 80.18,69 68.25,69 ; 68.25,69 L1.2 ; 68.25,69 U3.2
  Top Layer w1: 82.09,61.97 82.09,56.76
  vias: v2(79.25,69.4) v2(79.25,68.38) v2(79.25,67.24) v2(79.25,66.35) v2(79.25,65.33) v2(79.25,64.19) v2(80.52,69.4) v2(80.52,68.38) v2(80.52,67.24) v2(80.52,66.35) v2(80.52,65.33) v2(80.52,64.19) v2(81.79,69.4) v2(81.79,68.38) v2(81.79,67.24) v2(81.79,66.35) v2(81.79,65.33) v2(81.79,64.19) v2(82.93,69.4) v2(82.93,68.38) v2(82.93,67.24) v2(82.93,66.35) v2(82.93,65.33) v2(82.93,64.19) v2(84.2,69.4) v2(84.2,68.38) v2(84.2,67.24) v2(84.2,66.35) v2(84.2,65.33) v2(84.2,64.19) v2(85.47,69.4) v2(85.47,68.38) v2(85.47,67.24) v2(85.47,66.35) v2(85.47,65.33) v2(85.47,64.19)
$2N9: length 5.1
  Top Layer w0.8: U2.2 80.57,56.58 R2.2 R1.1
$2N10: length 3.3
  Top Layer w0.5: U2.4 83.8,53.65 83.94,53.51
$2N13: length 1.7
  Top Layer w0.8: LED1.1 47.81,46.68 47.81,48.3
$2N22: length 4.7
  Top Layer w0.254: R6.1 R7.2 72.59,38.14 71.84,38.9 U4.4
$2N25: length 3.5
  Top Layer w0.254: R8.1 30.25,45.46 29.45,44.66 28.06,44.66
$2N45: length 9.3
  Top Layer w0.254: U5.21 33.79,43.16 34.08,42.88 34.08,39.84 C8.2
$2N46: length 7.4
  Top Layer w0.254: C9.1 32.58,44.38 32.48,44.27 ; U5.22 30.84,43.66 31.33,44.14 32.48,44.14
$2N58: length 17.7
  Top Layer w0.254: v2(18.29,52.57) 18.28,52.56 R12.2
  Bottom Layer w0.254: J1.11 22.11,63.99 23.37,62.73 23.37,59.3 18.29,54.22 v2(18.29,52.57)
$2N73: length 4.7
  Top Layer w0.254: U1.6 118.13,55.87 116.46,55.87 115.57,54.98 C10.2
$2N74: length 5.8
  Top Layer w0.254: U1.8 119.15,53.61 118.49,52.95 116.59,52.95 115.82,52.19 C11.2
$2N79: length 8.1
  Top Layer w0.254: U1.27 119.65,61.32 v1(119.25,61.71) ; 113.9,62.22 115.82,62.22 v1(116.33,61.71)
  Bottom Layer w0.254: v1(119.25,61.71) v1(116.33,61.71)
$2N80: length 7.7
  Top Layer w0.254: R15.1 124.33,63.11 121.65,60.43 U1.23
$2N83: length 5
  Top Layer w0.254: U1.9 119.65,52.84 119.13,52.31 R19.2 R17.2
$2N84: length 5
  Top Layer w0.254: U1.10 120.15,52.69 120.65,52.19 R18.2 R20.2
$2N89: length 2.1
  Top Layer w0.254: R22.1 130.52,58.66 R21.3
$2N91: length 4.4
  Top Layer w0.254: R21.2 126.49,58.03 124.85,56.39 U1.17
$2N165: length 7.9
  Top Layer w0.254: 94.91,30.19 95,30.27 95,35.42 95.5,35.93 R27.1
$2N166: length 3.8
  Top Layer w0.254: 97.67,33.9 97.45,33.68 OPI2.36
$2N178: length 17.7
  Top Layer w0.254: v2(34.42,52.57) 35.71,52.57 R11.2
  Bottom Layer w0.254: v2(34.42,52.57) 34.42,53.71 28.7,59.43 28.7,62.73 30.28,64.3 J1.10
$2N181: length 10.9
  Top Layer w0.254: U5.2 26.8,46.32 30.64,50.16 J1.1
$2N182: length 8
  Top Layer w0.254: 26.3,45.43 26.3,49.11 J1.2
$2N183: length 10.3
  Top Layer w0.254: J1.3 28.1,54.72 28.1,51.68 25.8,49.38 25.8,45.43
$2N184: length 7.2
  Top Layer w0.254: J1.6 25.3,51.18 U5.5
$2N185: length 12.7
  Top Layer w0.254: C14.2 33.73,55.67 33.27,56.12 27.31,56.12 26.83,55.65 J1.4
$2N186: length 9.7
  Top Layer w0.254: J1.5 24.17,56.12 18.92,56.12 18.48,55.69 C13.2
$2N1673: length 1.6
  Top Layer w0.254: R9.1 32.52,36.39 LED2.2
$2N1674: length 1.9
  Top Layer w0.254: R10.1 23.24,36.83 23.02,36.61
$2N7600: length 6.7
  Top Layer w0.8: U8.2 U8.1 116.5,39.5 R38.2
$2N16339: length 2.9
  Top Layer w0.254: U10.10 51.04,38.84 49.78,37.58 C35.1
$2N16346: length 2.1
  Top Layer w0.254: U10.20 57.59,38.34 C34.1
$2N16349: length 2.4
  Top Layer w0.254: 49.25,39.36 49.27,39.34 U10.9
$2N24169: length 2.6
  Top Layer w0.5: U11.14 U17.1
$2N24402: length 2.1
  Top Layer w0.5: R34.2 135.07,50.22 U12.1
$2N24403: length 2.1
  Top Layer w0.5: U13.1 135.07,46.79 R35.2
$2N24404: length 2.1
  Top Layer w0.5: R36.2 136.98,43.42 U14.1
$2N24408: length 5.1
  Top Layer w0.5: U14.3 142.92,42.54 U15.5
$2N24409: length 4.7
  Top Layer w0.5: U13.3 143.72,45.84 U15.4
$2N24410: length 5.1
  Top Layer w0.5: U12.3 142.88,49.27 U15.3
$2N24486: length 1.9
  Top Layer w0.254: 136.92,37.64 135.07,37.64 R37.2
$2N28210: length 5.9
  Top Layer w0.5: laser.1 140.19,34.56 139.05,35.69 U16.3

## Copper pours and planes (outline as drawn; the poured copper is in the pictures)
24V on Top Layer: 96.39,65.91 97.78,64.51 106.8,64.51 107.31,64 107.31,55.74 106.68,55.11 84.96,55.11 84.84,55.24 84.84,58.41 85.22,58.79 91,58.79 92.46,60.25 92.46,68.32 96.39,68.32
24V on Bottom Layer: 105.03,60.7 107.06,60.7 107.06,58.67 105.03,58.67
+5V on Top Layer: 47.12,54.22 70.74,54.22 70.74,49.39 47.12,49.39
+5V on Top Layer: 65.91,49.65 70.74,49.65 70.74,46.47 65.91,46.47
+5V on Top Layer: 11.43,38.22 14.61,38.22 14.61,35.04 11.43,35.04
+5V on Top Layer: 9.02,8.63 12.32,8.63 12.32,5.58 9.02,5.58
+5V on Bottom Layer: 11.43,38.22 14.61,38.22 14.61,35.04 11.43,35.04
+5V on Bottom Layer: 65.91,49.65 70.74,49.65 70.74,46.47 65.91,46.47
$2N3 on Top Layer: 63.88,71.11 87.63,71.11 87.76,70.98 87.76,62.22 86.61,61.08 64.52,61.08 63.88,61.71

## Text on the board
Top Silkscreen Layer: USB2 | NET | DM | DP | MOTOR | B2 | B1 | A2 | A1 | + | FAN | EN_KEY | 夜燕Flex | 24/5/17 | V2.0
